# Altium project Fly-Balance.PrjPcb
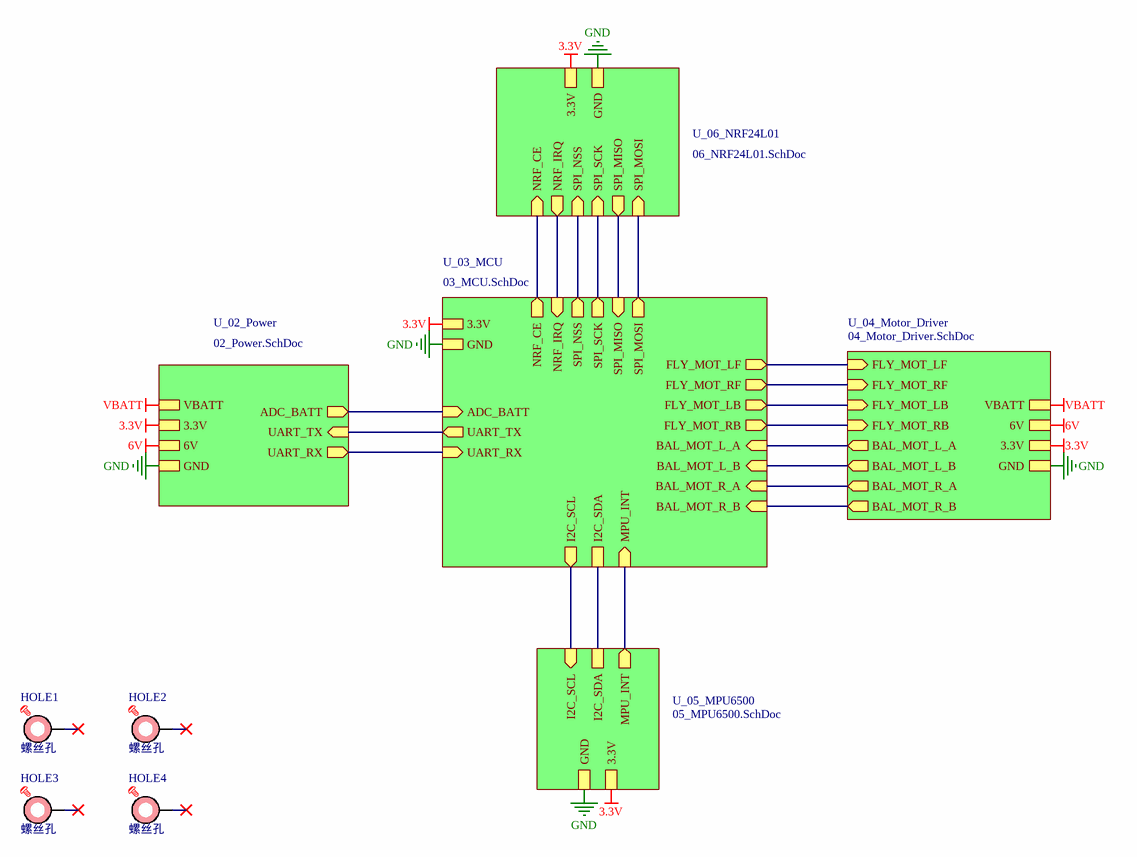
[diagram p0: 01_Fly-Balance.SchDoc]
6 sheets, 112 parts. Net scope: hierarchical (ports join the sheet entries above them; power ports are global).
Board files: Fly-Balance.PcbDoc, P-Fly-Balance.PcbDoc, 机架.PcbDoc
Sheets:
  01_Fly-Balance.SchDoc
    U_02_Power = 02_Power.SchDoc
    U_03_MCU = 03_MCU.SchDoc
    U_06_NRF24L01 = 06_NRF24L01.SchDoc
    U_04_Motor_Driver = 04_Motor_Driver.SchDoc
    U_05_MPU6500 = 05_MPU6500.SchDoc

## Sheet 01_Fly-Balance.SchDoc
size A4; CheckedBy: <审核日期>; Author: llm; CompanyName: 孔乙己图书店; DocumentNumber: 1; SheetNumber: 1; SheetTotal: 6; PageSetup: Record=PageOptions|CenterHorizontal=True|CenterVertical=True|PrintScale=1.00|XCorrection=1.00|YCorrection=1.00|PrintKind=0|BorderSize=5000000|LeftOffset=0|BottomOffset=0|Orientation=2|PaperLength=1000|PaperWidth=1000|Scale=100|PaperSource=7|PrintQuality=600|MediaType=1|DitherType=10|PaperKind=A4|PrintScaleMode=1; DesignDate: <设计日期>; CheckDate: <审核人员>; SheetName: Fly-Balance; SheetVersion: Rev.F; SheetDescription: <图纸描述>; productName: Fly-Balance

### Parts
HOLE1  螺丝孔  [HOLE-2.2]  (no BOM)
HOLE2  螺丝孔  [HOLE-2.2]  (no BOM)
HOLE3  螺丝孔  [HOLE-2.2]  (no BOM)
HOLE4  螺丝孔  [HOLE-2.2]  (no BOM)

### Sub-sheets
U_02_Power = 02_Power.SchDoc: 3.3V, GND, VBATT, ADC_BATT (out), UART_TX (in), UART_RX (out), 6V
U_03_MCU = 03_MCU.SchDoc: 3.3V, GND, FLY_MOT_LF (out), FLY_MOT_RF (out), FLY_MOT_LB (out), FLY_MOT_RB (out), MPU_INT (in), I2C_SCL (out), I2C_SDA, NRF_IRQ (in), NRF_CE (out), SPI_NSS (out), SPI_SCK (out), SPI_MISO (in), SPI_MOSI (out), ADC_BATT (in), UART_TX (out), UART_RX (in), BAL_MOT_R_A (in), BAL_MOT_L_A (in), BAL_MOT_R_B (in), BAL_MOT_L_B (in)
U_04_Motor_Driver = 04_Motor_Driver.SchDoc: FLY_MOT_LF (in), FLY_MOT_RF (in), FLY_MOT_LB (in), FLY_MOT_RB (in), VBATT, GND, 6V, BAL_MOT_R_B (out), BAL_MOT_L_A (out), BAL_MOT_L_B (out), BAL_MOT_R_A (out), 3.3V
U_05_MPU6500 = 05_MPU6500.SchDoc: 3.3V, GND, MPU_INT (out), I2C_SCL (in), I2C_SDA
U_06_NRF24L01 = 06_NRF24L01.SchDoc: NRF_IRQ (out), NRF_CE (in), SPI_NSS (in), SPI_SCK (in), SPI_MISO (out), SPI_MOSI (in), 3.3V, GND

### Nets
3.3V: sheet U_02_Power/3.3V, sheet U_03_MCU/3.3V, sheet U_06_NRF24L01/3.3V, sheet U_04_Motor_Driver/3.3V, sheet U_05_MPU6500/3.3V
6V: sheet U_02_Power/6V, sheet U_04_Motor_Driver/6V
GND: sheet U_02_Power/GND, sheet U_03_MCU/GND, sheet U_06_NRF24L01/GND, sheet U_04_Motor_Driver/GND, sheet U_05_MPU6500/GND
VBATT: sheet U_02_Power/VBATT, sheet U_04_Motor_Driver/VBATT
ADC_BATT: sheet U_02_Power/ADC_BATT, sheet U_03_MCU/ADC_BATT
BAL_MOT_L_A: sheet U_03_MCU/BAL_MOT_L_A, sheet U_04_Motor_Driver/BAL_MOT_L_A
BAL_MOT_L_B: sheet U_03_MCU/BAL_MOT_L_B, sheet U_04_Motor_Driver/BAL_MOT_L_B
BAL_MOT_LA: sheet U_03_MCU/FLY_MOT_LF, sheet U_04_Motor_Driver/FLY_MOT_LF
BAL_MOT_LB: sheet U_03_MCU/FLY_MOT_RF, sheet U_04_Motor_Driver/FLY_MOT_RF
BAL_MOT_R_A: sheet U_03_MCU/BAL_MOT_R_A, sheet U_04_Motor_Driver/BAL_MOT_R_A
BAL_MOT_R_B: sheet U_03_MCU/BAL_MOT_R_B, sheet U_04_Motor_Driver/BAL_MOT_R_B
BAL_MOT_RA: sheet U_03_MCU/FLY_MOT_LB, sheet U_04_Motor_Driver/FLY_MOT_LB
BAL_MOT_RB: sheet U_03_MCU/FLY_MOT_RB, sheet U_04_Motor_Driver/FLY_MOT_RB
I2C_SCL: sheet U_03_MCU/I2C_SCL, sheet U_05_MPU6500/I2C_SCL
I2C_SDA: sheet U_03_MCU/I2C_SDA, sheet U_05_MPU6500/I2C_SDA
MPU_INT: sheet U_03_MCU/MPU_INT, sheet U_05_MPU6500/MPU_INT
NRF_CE: sheet U_03_MCU/NRF_CE, sheet U_06_NRF24L01/NRF_CE
NRF_IRQ: sheet U_03_MCU/NRF_IRQ, sheet U_06_NRF24L01/NRF_IRQ
SPI_MISO: sheet U_03_MCU/SPI_MISO, sheet U_06_NRF24L01/SPI_MISO
SPI_MOSI: sheet U_03_MCU/SPI_MOSI, sheet U_06_NRF24L01/SPI_MOSI
SPI_NSS: sheet U_03_MCU/SPI_NSS, sheet U_06_NRF24L01/SPI_NSS
SPI_SCK: sheet U_03_MCU/SPI_SCK, sheet U_06_NRF24L01/SPI_SCK
UART_RX: sheet U_02_Power/UART_RX, sheet U_03_MCU/UART_RX
UART_TX: sheet U_02_Power/UART_TX, sheet U_03_MCU/UART_TX

Not connected (* = marked no-connect by the designer): HOLE1 1*; HOLE2 1*; HOLE3 1*; HOLE4 1*

### Notes on the sheet
- 1
- #
- 修改日期
- 修改内容
- 2
- 3
- 设计人员
- 审核人员
- 设计日期
- 审核日期
- 产品名称
- 图纸名称
- 产品型号
- 图纸描述
- 图纸版本
- A4

### Library data of the parts
HOLE1-HOLE4 = HOLE - 螺丝孔

## Sheet 02_Power.SchDoc
size A4; CheckedBy: <审核日期>; Author: llm; CompanyName: 孔乙己图书店; DocumentNumber: 2; SheetNumber: 2; SheetTotal: 6; PageSetup: Record=PageOptions|CenterHorizontal=True|CenterVertical=True|PrintScale=1.00|XCorrection=1.00|YCorrection=1.00|PrintKind=0|BorderSize=5000000|LeftOffset=0|BottomOffset=0|Orientation=2|PaperLength=1000|PaperWidth=1000|Scale=100|PaperSource=7|PrintQuality=600|MediaType=1|DitherType=10|PaperKind=A4|PrintScaleMode=1; DesignDate: <设计日期>; CheckDate: <审核人员>; SheetName: 电源; SheetVersion: Rev.F; SheetDescription: <图纸描述>; productName: Fly-Balance
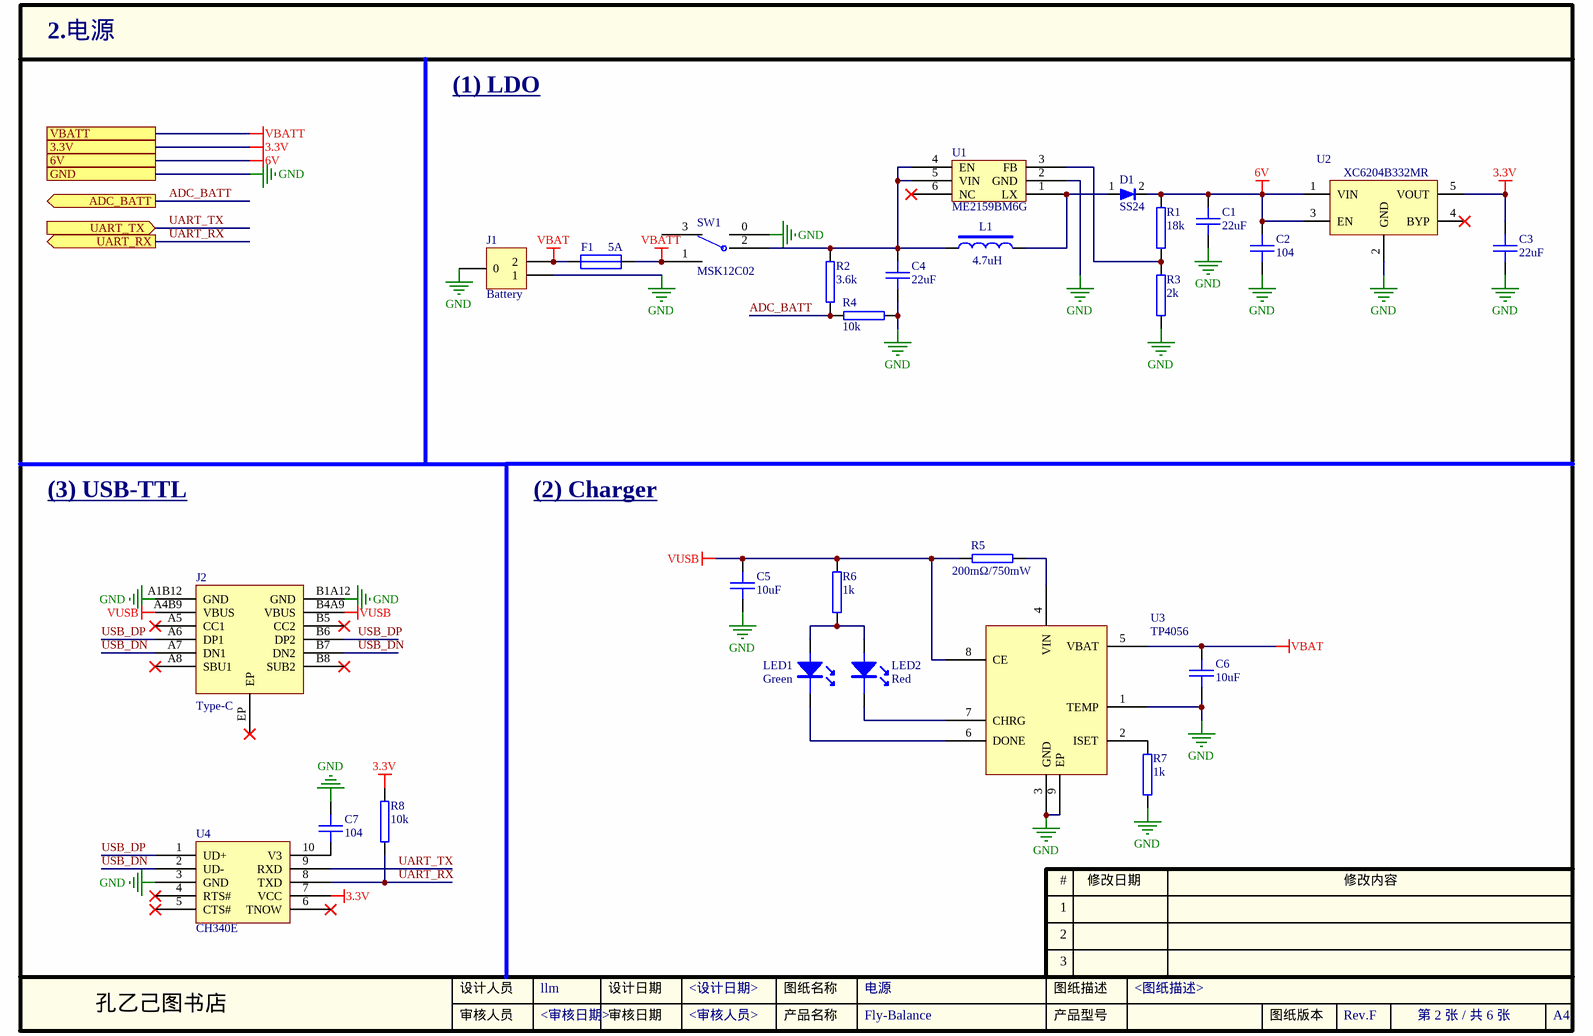
[diagram p1: 02_Power.SchDoc]

### Parts
C1  22uF  [0805C]
C2  104  [0402C]
C3  22uF  [0805C]
C4  22uF  [0805C]
C5  10uF  [0805C]
C6  10uF  [0805C]
C7  104  [0402C]
D1  SS24  [SMA_L4.3-W2.5-LS5.0-RD]
F1  5A  [1206R]
J1  Battery  [51005母座]
J2  Type-C  [USB-C-SMD_TYPE-C-16P-1]
L1  4.7uH  [IND-SMD_L5.0-W5.0_FNR50XXS]
LED1  Green  [LED-0603]
LED2  Red  [LED-0603]
R1  18k  [0402R]
R2  3.6k  [0402R]
R3  2k  [0402R]
R4  10k  [0402R]
R5  200mΩ/750mW  [2010R]
R6  1k  [0402R]
R7  1k  [0402R]
R8  10k  [0402R]
SW1  MSK12C02  [MSK12C02]
U1  ME2159BM6G  [SOT-23-6_L2.9-W1.6-P0.95-LS2.8-BR]
U2  XC6204B332MR  [SOT-23-5]
U3  TP4056  [ESOP-8_L4.9-W3.9-P1.27-LS6.0-BL-EP]
U4  CH340E  [MSOP-10_L3.0-W3.0-P0.50-LS5.0-BL]

### Ports
3.3V, 6V, ADC_BATT (out), GND, UART_RX (out), UART_TX (in), VBATT

### Nets
3.3V: C3.1 R8.2 U2.5(VOUT) U4.7(VCC) ; port 3.3V
6V: C1.1 C2.1 D1.2 R1.2 U2.1(VIN) U2.3(EN) ; port 6V
GND: C1.2 C2.2 C3.2 C4.2 C5.2 C6.2 C7.2 J1.0 J1.1 J2.A1B12(GND) J2.B1A12(GND) R3.1 R4.1 R7.1 SW1.0 U1.2(GND) U2.2(GND) U3.1(TEMP) U3.3(GND) U3.9(EP) U4.3(GND) ; port GND
VBAT: C6.1 F1.2 J1.2 U3.5(VBAT)
VBATT: F1.1 SW1.1 ; port VBATT
VUSB: C5.1 J2.A4B9(VBUS) J2.B4A9(VBUS) R5.2 R6.2 U3.8(CE)
ADC_BATT: R2.1 R4.2 ; port ADC_BATT
UART_RX: R8.1 U4.8(TXD) ; port UART_RX
UART_TX: U4.9(RXD) ; port UART_TX
USB_DN: J2.A7(DN1) J2.B7(DN2) U4.2(UD-)
USB_DP: J2.A6(DP1) J2.B6(DP2) U4.1(UD+)
NetC4_1: C4.1 L1.1 R2.2 SW1.2 U1.4(EN) U1.5(VIN)
NetC7_1: C7.1 U4.10(V3)
NetD1_1: D1.1 L1.2 U1.1(LX)
NetLED1_1: LED1.1 LED2.1 R6.1
NetLED1_2: LED1.2 U3.6(DONE)
NetLED2_2: LED2.2 U3.7(CHRG)
NetR1_1: R1.1 R3.2 U1.3(FB)
NetR5_1: R5.1 U3.4(VIN)
NetR7_2: R7.2 U3.2(ISET)

Not connected (* = marked no-connect by the designer): J2 A5(CC1)* A8(SBU1)* B5(CC2)* B8(SUB2)* EP*; SW1 3; U1 6(NC)*; U2 4(BYP)*; U4 4(RTS#)* 5(CTS#)* 6(TNOW)*

### Notes on the sheet
- (1) LDO
- (3) USB-TTL
- (2) Charger
- 1
- #
- 修改日期
- 修改内容
- 2
- 3
- 设计人员
- 审核人员
- 设计日期
- 审核日期
- 产品名称
- 图纸名称
- 产品型号
- 图纸描述
- 图纸版本
- A4

### Library data of the parts
C1-C7 = CAP: 电容
D1 = DIODE: 二极管
F1 = Fuse: 保险丝
J1 = CON: 直流电机接口
L1 = INDUCTOR_2: 电感
LED1 LED2 = LED: 发光二极管; Value: 0603Red,SMD
R1-R8 = RES: 电阻
SW1 = 单刀双掷开关
U1 = ME2159BM6G: DC-DC升压芯片
U2 = ZL6205A30TS5: LDO, 3.0V输出
U3 = 4056: 单节锂电池充电芯片
U4 = CH340E: USB-TTL芯片

## Sheet 03_MCU.SchDoc
size A4; CheckedBy: <审核日期>; Author: llm; CompanyName: 孔乙己图书店; DocumentNumber: 3; SheetNumber: 3; SheetTotal: 6; PageSetup: Record=PageOptions|CenterHorizontal=True|CenterVertical=True|PrintScale=1.00|XCorrection=1.00|YCorrection=1.00|PrintKind=0|BorderSize=5000000|LeftOffset=0|BottomOffset=0|Orientation=2|PaperLength=1000|PaperWidth=1000|Scale=100|PaperSource=7|PrintQuality=600|MediaType=1|DitherType=10|PaperKind=A4|PrintScaleMode=1; DesignDate: <设计日期>; CheckDate: <审核人员>; SheetName: MCU系统电路; SheetVersion: Rev.F; SheetDescription: <图纸描述>; productName: Fly-Balance
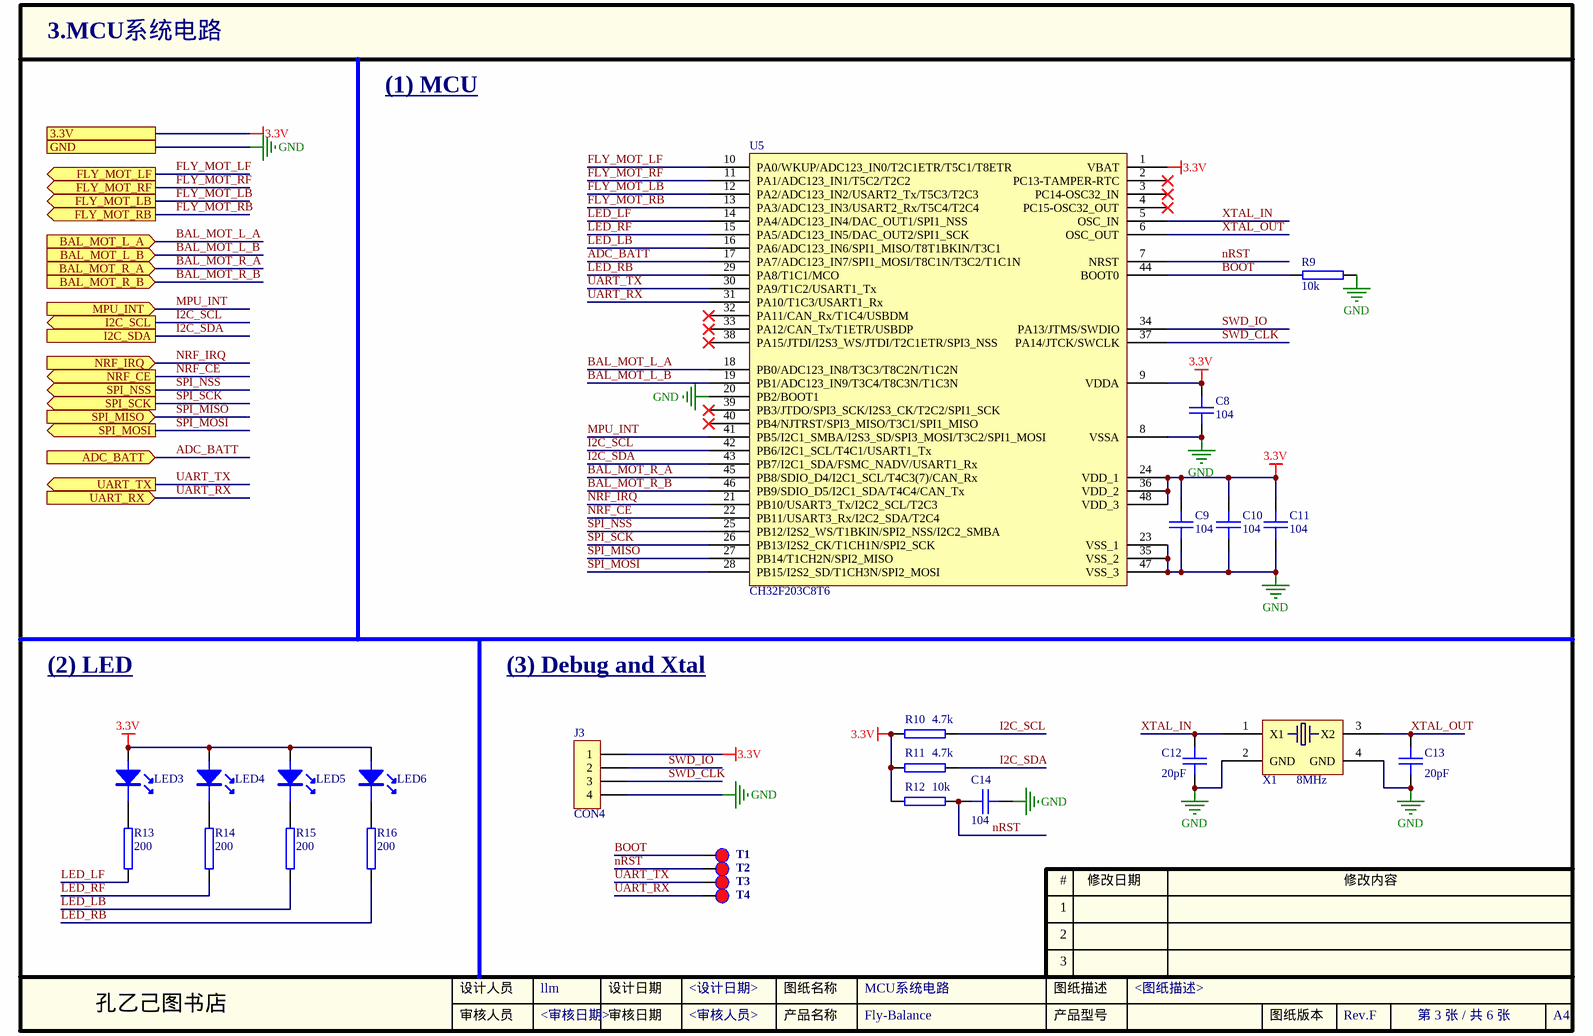
[diagram p2: 03_MCU.SchDoc]

### Parts
C8  104  [0402C]
C9  104  [0402C]
C10  104  [0402C]
C11  104  [0402C]
C12  20pF  [0402C]
C13  20pF  [0402C]
C14  104  [0402C]
J3  CON4  [SIP-4-2.54]
LED3  Blue  [LED-0603]  (value not drawn)
LED4  Blue  [LED-0603]  (value not drawn)
LED5  Blue  [LED-0603]  (value not drawn)
LED6  Blue  [LED-0603]  (value not drawn)
R9  10k  [0402R]
R10  4.7k  [0402R]
R11  4.7k  [0402R]
R12  10k  [0402R]
R13  200  [0402R]
R14  200  [0402R]
R15  200  [0402R]
R16  200  [0402R]
T1  BOOT  [PAD-40]  (value not drawn)  (no BOM)
T2  RST  [PAD-40]  (value not drawn)  (no BOM)
T3  Tx  [PAD-40]  (value not drawn)  (no BOM)
T4  Rx  [PAD-40]  (value not drawn)  (no BOM)
U5  CH32F203C8T6  [LQFP-48_7x7]
X1  8MHz  [OSCCC250X320X80-4N]

### Ports
3.3V, ADC_BATT (in), BAL_MOT_L_A (in), BAL_MOT_L_B (in), BAL_MOT_R_A (in), BAL_MOT_R_B (in), FLY_MOT_LB (out), FLY_MOT_LF (out), FLY_MOT_RB (out), FLY_MOT_RF (out), GND, I2C_SCL (out), I2C_SDA, MPU_INT (in), NRF_CE (out), NRF_IRQ (in), SPI_MISO (in), SPI_MOSI (out), SPI_NSS (out), SPI_SCK (out), UART_RX (in), UART_TX (out)

### Nets
3.3V: C8.2 C9.2 C10.2 C11.2 J3.1 LED3.1 LED4.1 LED5.1 LED6.1 R10.2 R11.2 R12.2 U5.1(VBAT) U5.9(VDDA) U5.24(VDD_1) U5.36(VDD_2) U5.48(VDD_3) ; port 3.3V
GND: C8.1 C9.1 C10.1 C11.1 C12.1 C13.1 C14.1 J3.4 R9.2 U5.8(VSSA) U5.20(PB2/BOOT1) U5.23(VSS_1) U5.35(VSS_2) U5.47(VSS_3) X1.2(GND) X1.4(GND) ; port GND
ADC_BATT: U5.17(PA7/ADC123_IN7/SPI1_MOSI/T8C1N/T3C2/T1C1N) ; port ADC_BATT
BAL_MOT_L_A: U5.18(PB0/ADC123_IN8/T3C3/T8C2N/T1C2N) ; port BAL_MOT_L_A
BAL_MOT_L_B: U5.19(PB1/ADC123_IN9/T3C4/T8C3N/T1C3N) ; port BAL_MOT_L_B
BAL_MOT_R_A: U5.45(PB8/SDIO_D4/I2C1_SCL/T4C3(7)/CAN_Rx) ; port BAL_MOT_R_A
BAL_MOT_R_B: U5.46(PB9/SDIO_D5/I2C1_SDA/T4C4/CAN_Tx) ; port BAL_MOT_R_B
BOOT: R9.1 T1.1 U5.44(BOOT0)
FLY_MOT_LB: U5.12(PA2/ADC123_IN2/USART2_Tx/T5C3/T2C3) ; port FLY_MOT_LB  [project net BAL_MOT_RA]
FLY_MOT_LF: U5.10(PA0/WKUP/ADC123_IN0/T2C1ETR/T5C1/T8ETR) ; port FLY_MOT_LF  [project net BAL_MOT_LA]
FLY_MOT_RB: U5.13(PA3/ADC123_IN3/USART2_Rx/T5C4/T2C4) ; port FLY_MOT_RB  [project net BAL_MOT_RB]
FLY_MOT_RF: U5.11(PA1/ADC123_IN1/T5C2/T2C2) ; port FLY_MOT_RF  [project net BAL_MOT_LB]
I2C_SCL: R10.1 U5.42(PB6/I2C1_SCL/T4C1/USART1_Tx) ; port I2C_SCL
I2C_SDA: R11.1 U5.43(PB7/I2C1_SDA/FSMC_NADV/USART1_Rx) ; port I2C_SDA
LED_LB: R15.1 U5.16(PA6/ADC123_IN6/SPI1_MISO/T8T1BKIN/T3C1)
LED_LF: R13.1 U5.14(PA4/ADC123_IN4/DAC_OUT1/SPI1_NSS)
LED_RB: R16.1 U5.29(PA8/T1C1/MCO)
LED_RF: R14.1 U5.15(PA5/ADC123_IN5/DAC_OUT2/SPI1_SCK)
MPU_INT: U5.41(PB5/I2C1_SMBA/I2S3_SD/SPI3_MOSI/T3C2/SPI1_MOSI) ; port MPU_INT
NRF_CE: U5.22(PB11/USART3_Rx/I2C2_SDA/T2C4) ; port NRF_CE
NRF_IRQ: U5.21(PB10/USART3_Tx/I2C2_SCL/T2C3) ; port NRF_IRQ
nRST: C14.2 R12.1 T2.1 U5.7(NRST)
SPI_MISO: U5.27(PB14/T1CH2N/SPI2_MISO) ; port SPI_MISO
SPI_MOSI: U5.28(PB15/I2S2_SD/T1CH3N/SPI2_MOSI) ; port SPI_MOSI
SPI_NSS: U5.25(PB12/I2S2_WS/T1BKIN/SPI2_NSS/I2C2_SMBA) ; port SPI_NSS
SPI_SCK: U5.26(PB13/I2S2_CK/T1CH1N/SPI2_SCK) ; port SPI_SCK
SWD_CLK: J3.3 U5.37(PA14/JTCK/SWCLK)
SWD_IO: J3.2 U5.34(PA13/JTMS/SWDIO)
UART_RX: T4.1 U5.31(PA10/T1C3/USART1_Rx) ; port UART_RX
UART_TX: T3.1 U5.30(PA9/T1C2/USART1_Tx) ; port UART_TX
XTAL_IN: C12.2 U5.5(OSC_IN) X1.1(X1)
XTAL_OUT: C13.2 U5.6(OSC_OUT) X1.3(X2)
NetLED3_2: LED3.2 R13.2
NetLED4_2: LED4.2 R14.2
NetLED5_2: LED5.2 R15.2
NetLED6_2: LED6.2 R16.2

Not connected (* = marked no-connect by the designer): U5 2(PC13-TAMPER-RTC)* 3(PC14-OSC32_IN)* 4(PC15-OSC32_OUT)* 32(PA11/CAN_Rx/T1C4/USBDM)* 33(PA12/CAN_Tx/T1ETR/USBDP)* 38(PA15/JTDI/I2S3_WS/JTDI/T2C1ETR/SPI3_NSS)* 39(PB3/JTDO/SPI3_SCK/I2S3_CK/T2C2/SPI1_SCK)* 40(PB4/NJTRST/SPI3_MISO/T3C1/SPI1_MISO)*

### Notes on the sheet
- (1) MCU
- (2) LED
- (3) Debug and Xtal
- 1
- #
- 修改日期
- 修改内容
- 2
- 3
- 设计人员
- 审核人员
- 设计日期
- 审核日期
- 产品名称
- 图纸名称
- 产品型号
- 图纸描述
- 图纸版本
- A4

### Library data of the parts
C8-C14 = CAP: 电容
J3 = CON4: Connector
LED3-LED6 = LED: 发光二极管; Value: 0603Red,SMD
R9-R16 = RES: 电阻
T1-T4 = TEST-DOT: 测试点
U5 = STM32F103C: STM32单片机48引脚
X1 = XTAL4: 4pin贴片无源晶振

## Sheet 06_NRF24L01.SchDoc
size A4; CheckedBy: <审核日期>; Author: llm; CompanyName: 孔乙己图书店; DocumentNumber: 6; SheetNumber: 6; SheetTotal: 6; PageSetup: Record=PageOptions|CenterHorizontal=True|CenterVertical=True|PrintScale=1.00|XCorrection=1.00|YCorrection=1.00|PrintKind=0|BorderSize=5000000|LeftOffset=0|BottomOffset=0|Orientation=2|PaperLength=1000|PaperWidth=1000|Scale=100|PaperSource=7|PrintQuality=600|MediaType=1|DitherType=10|PaperKind=A4|PrintScaleMode=1; DesignDate: <设计日期>; CheckDate: <审核人员>; SheetName: 无线通信; SheetVersion: Rev.F; SheetDescription: <图纸描述>; productName: Fly-Balance
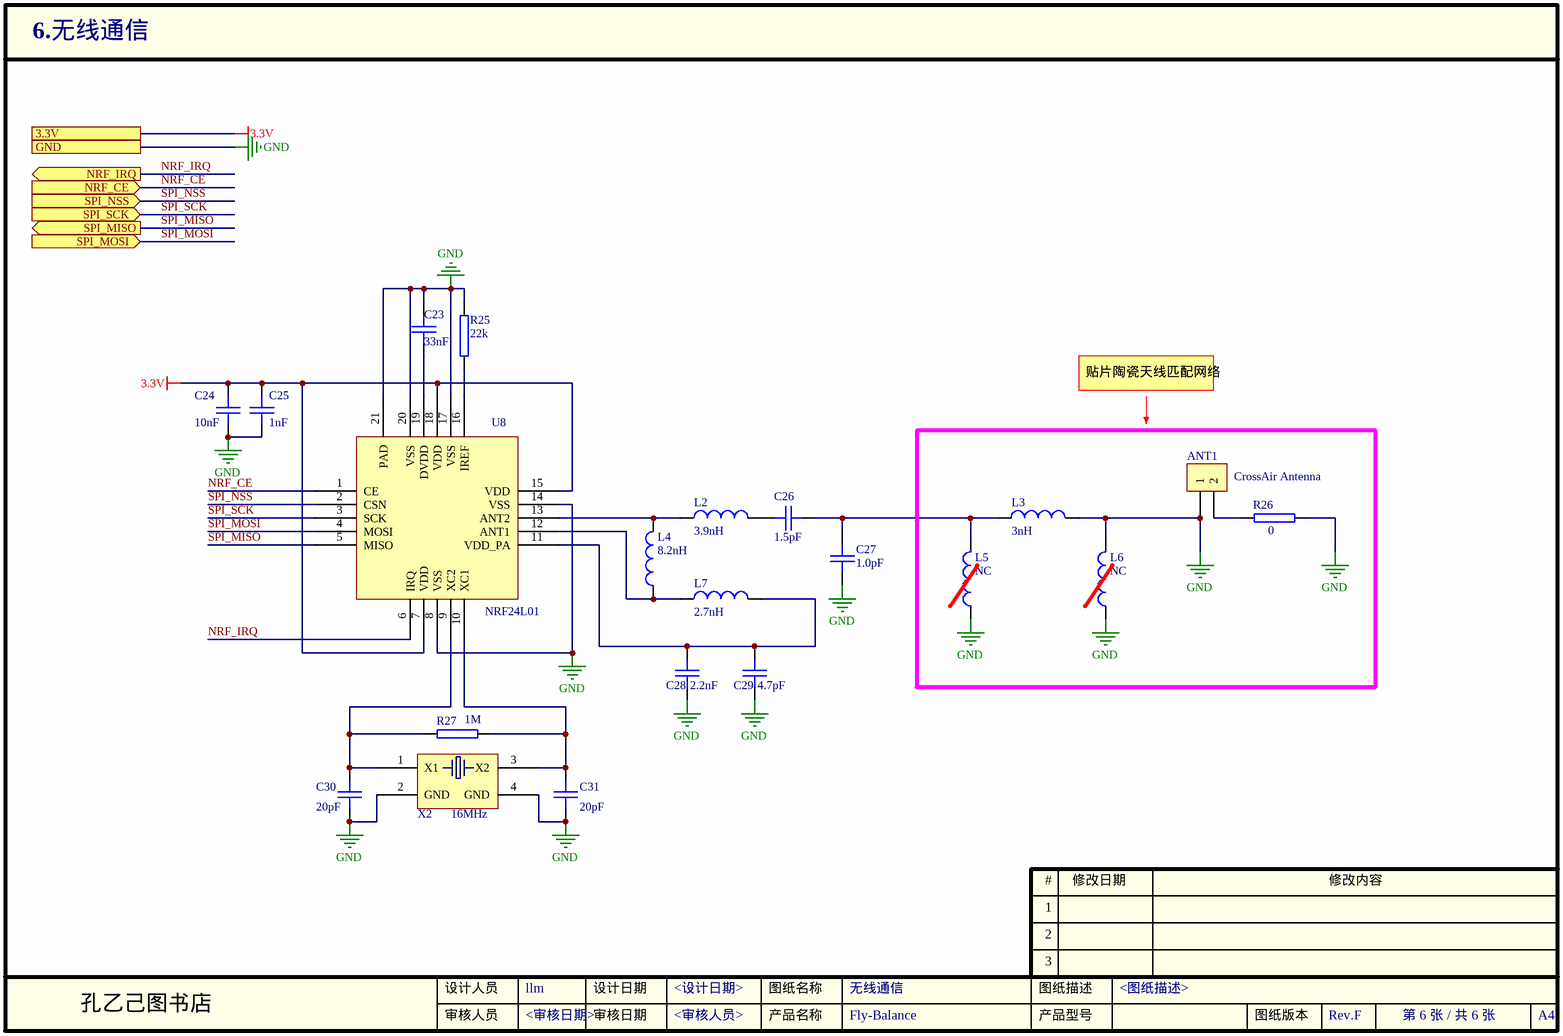
[diagram p3: 06_NRF24L01.SchDoc]

### Parts
ANT1  CrossAir Antenna  [ANT-SMD_L3.1-W1.6]
C23  33nF  [0402C]
C24  10nF  [0402C]
C25  1nF  [0402C]
C26  1.5pF  [0402C]
C27  1.0pF  [0402C]
C28  2.2nF  [0402C]
C29  4.7pF  [0402C]
C30  20pF  [0402C]
C31  20pF  [0402C]
L2  3.9nH  [0402R]
L3  3nH  [0402R]
L4  8.2nH  [0402R]
L5  NC  [0402R]
L6  NC  [0402R]
L7  2.7nH  [0402R]
R25  22k  [0402R]
R26  0  [0402R]
R27  1M  [0402R]
U8  NRF24L01  [QFN-20_L4.0-W4.0-P0.50-BL-EP]
X2  16MHz  [OSCCC250X320X80-4N]

### Ports
3.3V, GND, NRF_CE (in), NRF_IRQ (out), SPI_MISO (out), SPI_MOSI (in), SPI_NSS (in), SPI_SCK (in)

### Nets
3.3V: C24.1 C25.1 U8.7(VDD) U8.15(VDD) U8.18(VDD) ; port 3.3V
GND: ANT1.1 C23.1 C24.2 C25.2 C27.1 C28.2 C29.2 C30.1 C31.1 L3.2 L5.1 L6.1 L6.2 R25.1 R26.2 U8.8(VSS) U8.14(VSS) U8.17(VSS) U8.20(VSS) U8.21(PAD) X2.2(GND) X2.4(GND) ; port GND
NRF_CE: U8.1(CE) ; port NRF_CE
NRF_IRQ: U8.6(IRQ) ; port NRF_IRQ
SPI_MISO: U8.5(MISO) ; port SPI_MISO
SPI_MOSI: U8.4(MOSI) ; port SPI_MOSI
SPI_NSS: U8.2(CSN) ; port SPI_NSS
SPI_SCK: U8.3(SCK) ; port SPI_SCK
NetANT1_2: ANT1.2 R26.1
NetC23_2: C23.2 U8.19(DVDD)
NetC26_1: C26.1 L2.2
NetC26_2: C26.2 C27.2 L3.1 L5.2
NetC28_1: C28.1 C29.1 L7.2 U8.11(VDD_PA)
NetC30_2: C30.2 R27.1 U8.9(XC2) X2.1(X1)
NetC31_2: C31.2 R27.2 U8.10(XC1) X2.3(X2)
NetL2_1: L2.1 L4.2 U8.13(ANT2)
NetL4_1: L4.1 L7.1 U8.12(ANT1)
NetR25_2: R25.2 U8.16(IREF)

### Notes on the sheet
- 贴片陶瓷天线匹配网络
- 1
- #
- 修改日期
- 修改内容
- 2
- 3
- 设计人员
- 审核人员
- 设计日期
- 审核日期
- 产品名称
- 图纸名称
- 产品型号
- 图纸描述
- 图纸版本
- A4

### Library data of the parts
ANT1 = CON2: Connector
C23-C31 = CAP: 电容
L2-L7 = INDUCTOR_1: 电感
R25-R27 = RES: 电阻
U8 = NRF24L01: 2.4G无线通信芯片
X2 = XTAL4: 4pin贴片无源晶振

## Sheet 04_Motor_Driver.SchDoc
size A4; CheckedBy: <审核日期>; Author: llm; CompanyName: 孔乙己图书店; DocumentNumber: 4; SheetNumber: 4; SheetTotal: 6; PageSetup: Record=PageOptions|CenterHorizontal=True|CenterVertical=True|PrintScale=1.00|XCorrection=1.00|YCorrection=1.00|PrintKind=0|BorderSize=5000000|LeftOffset=0|BottomOffset=0|Orientation=2|PaperLength=1000|PaperWidth=1000|Scale=100|PaperSource=7|PrintQuality=600|MediaType=1|DitherType=10|PaperKind=A4|PrintScaleMode=1; DesignDate: <设计日期>; CheckDate: <审核人员>; SheetName: 电机驱动; SheetVersion: Rev.F; SheetDescription: <图纸描述>; productName: Fly-Balance
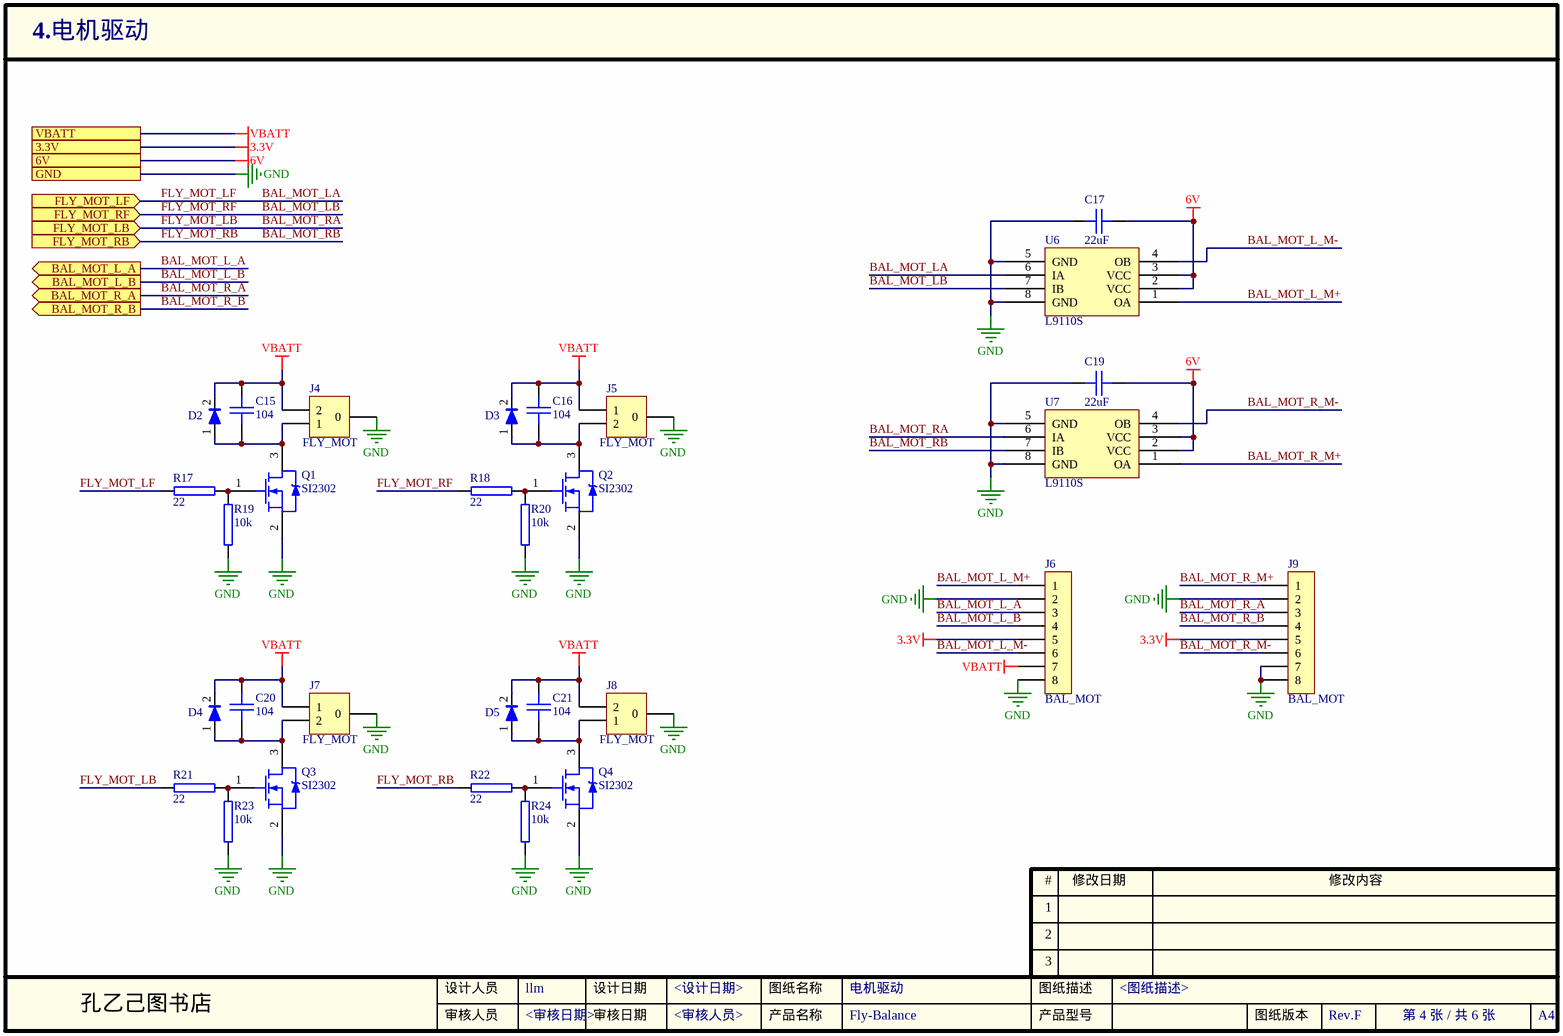
[diagram p4: 04_Motor_Driver.SchDoc]

### Parts
C15  104  [0402C]
C16  104  [0402C]
C17  22uF  [0805C]
C19  22uF  [0805C]
C20  104  [0402C]
C21  104  [0402C]
D2  1N4001  [SOD-323]  (value not drawn)
D3  1N4001  [SOD-323]  (value not drawn)
D4  1N4001  [SOD-323]  (value not drawn)
D5  1N4001  [SOD-323]  (value not drawn)
J4  FLY_MOT  [CONN-SMD_2P-P1.25]
J5  FLY_MOT  [CONN-SMD_2P-P1.25]
J6  BAL_MOT  [CONN-SMD_6P-P2.00_DEALON_PH-6PWB]
J7  FLY_MOT  [CONN-SMD_2P-P1.25]
J8  FLY_MOT  [CONN-SMD_2P-P1.25]
J9  BAL_MOT  [CONN-SMD_6P-P2.00_DEALON_PH-6PWB]
Q1  SI2302  [SOT-23]
Q2  SI2302  [SOT-23]
Q3  SI2302  [SOT-23]
Q4  SI2302  [SOT-23]
R17  22  [0402R]
R18  22  [0402R]
R19  10k  [0402R]
R20  10k  [0402R]
R21  22  [0402R]
R22  22  [0402R]
R23  10k  [0402R]
R24  10k  [0402R]
U6  L9110S  [SOP-8_L4.9-W3.9-P1.27-LS6.0-BL]
U7  L9110S  [SOP-8_L4.9-W3.9-P1.27-LS6.0-BL]

### Ports
3.3V, 6V, BAL_MOT_L_A (out), BAL_MOT_L_B (out), BAL_MOT_R_A (out), BAL_MOT_R_B (out), FLY_MOT_LB (in), FLY_MOT_LF (in), FLY_MOT_RB (in), FLY_MOT_RF (in), GND, VBATT

### Nets
3.3V: J6.5 J9.5 ; port 3.3V
6V: C17.1 C19.1 U6.2(VCC) U6.3(VCC) U7.2(VCC) U7.3(VCC) ; port 6V
GND: C17.2 C19.2 J4.0 J5.0 J6.2 J6.8 J7.0 J8.0 J9.2 J9.7 J9.8 Q1.2(S) Q2.2(S) Q3.2(S) Q4.2(S) R19.2 R20.2 R23.2 R24.2 U6.5(GND) U6.8(GND) U7.5(GND) U7.8(GND) ; port GND
VBATT: C15.1 C16.1 C20.1 C21.1 D2.2 D3.2 D4.2 D5.2 J4.2 J5.1 J6.7 J7.1 J8.2 ; port VBATT
BAL_MOT_L_A: J6.3 ; port BAL_MOT_L_A
BAL_MOT_L_B: J6.4 ; port BAL_MOT_L_B
BAL_MOT_L_M+: J6.1 U6.1(OA)
BAL_MOT_L_M-: J6.6 U6.4(OB)
BAL_MOT_LA: R17.2 U6.6(IA) ; port FLY_MOT_LF  [also labelled FLY_MOT_LF]
BAL_MOT_LB: R18.2 U6.7(IB) ; port FLY_MOT_RF  [also labelled FLY_MOT_RF]
BAL_MOT_R_A: J9.3 ; port BAL_MOT_R_A
BAL_MOT_R_B: J9.4 ; port BAL_MOT_R_B
BAL_MOT_R_M+: J9.1 U7.1(OA)
BAL_MOT_R_M-: J9.6 U7.4(OB)
BAL_MOT_RA: R21.2 U7.6(IA) ; port FLY_MOT_LB  [also labelled FLY_MOT_LB]
BAL_MOT_RB: R22.2 U7.7(IB) ; port FLY_MOT_RB  [also labelled FLY_MOT_RB]
NetC15_2: C15.2 D2.1 J4.1 Q1.3(D)
NetC16_2: C16.2 D3.1 J5.2 Q2.3(D)
NetC20_2: C20.2 D4.1 J7.2 Q3.3(D)
NetC21_2: C21.2 D5.1 J8.1 Q4.3(D)
NetQ1_1: Q1.1(G) R17.1 R19.1
NetQ2_1: Q2.1(G) R18.1 R20.1
NetQ3_1: Q3.1(G) R21.1 R23.1
NetQ4_1: Q4.1(G) R22.1 R24.1

### Notes on the sheet
- 1
- #
- 修改日期
- 修改内容
- 2
- 3
- 设计人员
- 审核人员
- 设计日期
- 审核日期
- 产品名称
- 图纸名称
- 产品型号
- 图纸描述
- 图纸版本
- A4

### Library data of the parts
C15-C17 C19-C21 = CAP: 电容
D2-D5 = DIODE: 二极管
J4 J5 J7 J8 = CON: 直流电机接口
J6 J9 = CON8: Connector
Q1-Q4 = N-MOS: N-MOSFET
R17-R24 = RES: 电阻
U6 U7 = L9110S: H桥电机驱动芯片

## Sheet 05_MPU6500.SchDoc
size A4; CheckedBy: <审核日期>; Author: llm; CompanyName: 孔乙己图书店; DocumentNumber: 5; SheetNumber: 5; SheetTotal: 6; PageSetup: Record=PageOptions|CenterHorizontal=True|CenterVertical=True|PrintScale=1.00|XCorrection=1.00|YCorrection=1.00|PrintKind=0|BorderSize=5000000|LeftOffset=0|BottomOffset=0|Orientation=2|PaperLength=1000|PaperWidth=1000|Scale=100|PaperSource=7|PrintQuality=600|MediaType=1|DitherType=10|PaperKind=A4|PrintScaleMode=1; DesignDate: <设计日期>; CheckDate: <审核人员>; SheetName: 姿态检测; SheetVersion: Rev.F; SheetDescription: <图纸描述>; productName: Fly-Balance
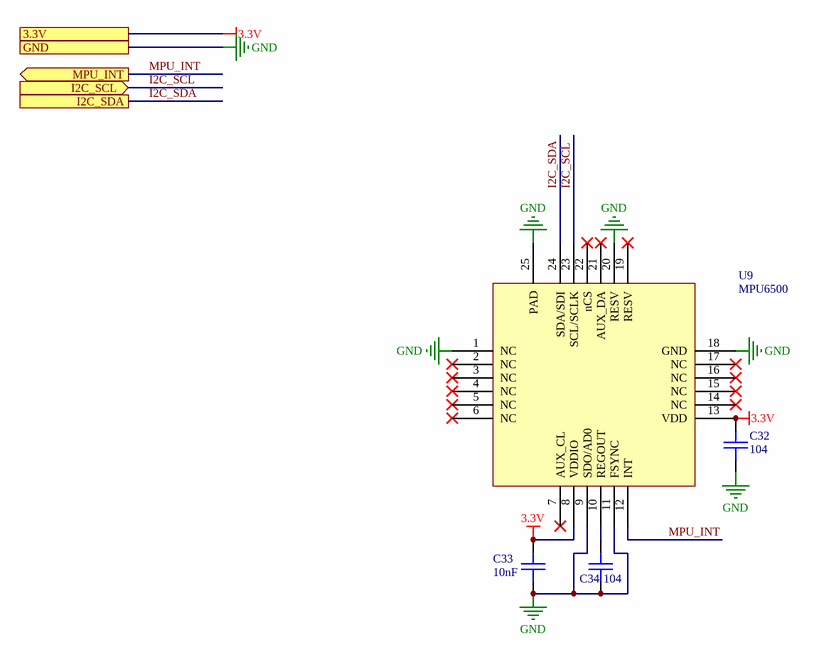
[diagram p5: 05_MPU6500.SchDoc]

### Parts
C32  104  [0402C]
C33  10nF  [0402C]
C34  104  [0402C]
U9  MPU6500  [QFN-24_L3.0-W3.0-P0.40-BL-EP]

### Ports
3.3V, GND, I2C_SCL (in), I2C_SDA, MPU_INT (out)

### Nets
3.3V: C32.1 C33.2 U9.8(VDDIO) U9.13(VDD) ; port 3.3V
GND: C32.2 C33.1 C34.2 U9.1(NC) U9.9(SDO/AD0) U9.11(FSYNC) U9.18(GND) U9.20(RESV) U9.25(PAD) ; port GND
I2C_SCL: U9.23(SCL/SCLK) ; port I2C_SCL
I2C_SDA: U9.24(SDA/SDI) ; port I2C_SDA
MPU_INT: U9.12(INT) ; port MPU_INT
NetC34_1: C34.1 U9.10(REGOUT)

Not connected (* = marked no-connect by the designer): U9 2(NC)* 3(NC)* 4(NC)* 5(NC)* 6(NC)* 7(AUX_CL)* 14(NC)* 15(NC)* 16(NC)* 17(NC)* 19(RESV)* 21(AUX_DA)* 22(nCS)*

### Notes on the sheet
- 1
- #
- 修改日期
- 修改内容
- 2
- 3
- 设计人员
- 审核人员
- 设计日期
- 审核日期
- 产品名称
- 图纸名称
- 产品型号
- 图纸描述
- 图纸版本
- A4

### Library data of the parts
C32-C34 = CAP: 电容
U9 = MPU6500: 三轴加速度计和三轴陀螺仪

## Nets that join several sheets
3.3V: 02_Power (C3.1 R8.2 U2.5 U4.7), 03_MCU (17 pins), 06_NRF24L01 (5 pins), 04_Motor_Driver (J6.5 J9.5), 05_MPU6500 (C32.1 C33.2 U9.8 U9.13)
6V: 02_Power (6 pins), 04_Motor_Driver (6 pins)
GND: 02_Power (21 pins), 03_MCU (16 pins), 06_NRF24L01 (22 pins), 04_Motor_Driver (23 pins), 05_MPU6500 (9 pins)
VBATT: 02_Power (F1.1 SW1.1), 04_Motor_Driver (13 pins)
ADC_BATT: 02_Power (R2.1 R4.2), 03_MCU (U5.17)
BAL_MOT_L_A: 03_MCU (U5.18), 04_Motor_Driver (J6.3)
BAL_MOT_L_B: 03_MCU (U5.19), 04_Motor_Driver (J6.4)
BAL_MOT_LA: 03_MCU (U5.10), 04_Motor_Driver (R17.2 U6.6)
BAL_MOT_LB: 03_MCU (U5.11), 04_Motor_Driver (R18.2 U6.7)
BAL_MOT_R_A: 03_MCU (U5.45), 04_Motor_Driver (J9.3)
BAL_MOT_R_B: 03_MCU (U5.46), 04_Motor_Driver (J9.4)
BAL_MOT_RA: 03_MCU (U5.12), 04_Motor_Driver (R21.2 U7.6)
BAL_MOT_RB: 03_MCU (U5.13), 04_Motor_Driver (R22.2 U7.7)
I2C_SCL: 03_MCU (R10.1 U5.42), 05_MPU6500 (U9.23)
I2C_SDA: 03_MCU (R11.1 U5.43), 05_MPU6500 (U9.24)
MPU_INT: 03_MCU (U5.41), 05_MPU6500 (U9.12)
NRF_CE: 03_MCU (U5.22), 06_NRF24L01 (U8.1)
NRF_IRQ: 03_MCU (U5.21), 06_NRF24L01 (U8.6)
SPI_MISO: 03_MCU (U5.27), 06_NRF24L01 (U8.5)
SPI_MOSI: 03_MCU (U5.28), 06_NRF24L01 (U8.4)
SPI_NSS: 03_MCU (U5.25), 06_NRF24L01 (U8.2)
SPI_SCK: 03_MCU (U5.26), 06_NRF24L01 (U8.3)
UART_RX: 02_Power (R8.1 U4.8), 03_MCU (T4.1 U5.31)
UART_TX: 02_Power (U4.9), 03_MCU (T3.1 U5.30)